# Altium schematic sheet Sheet2.SchDoc
size A2
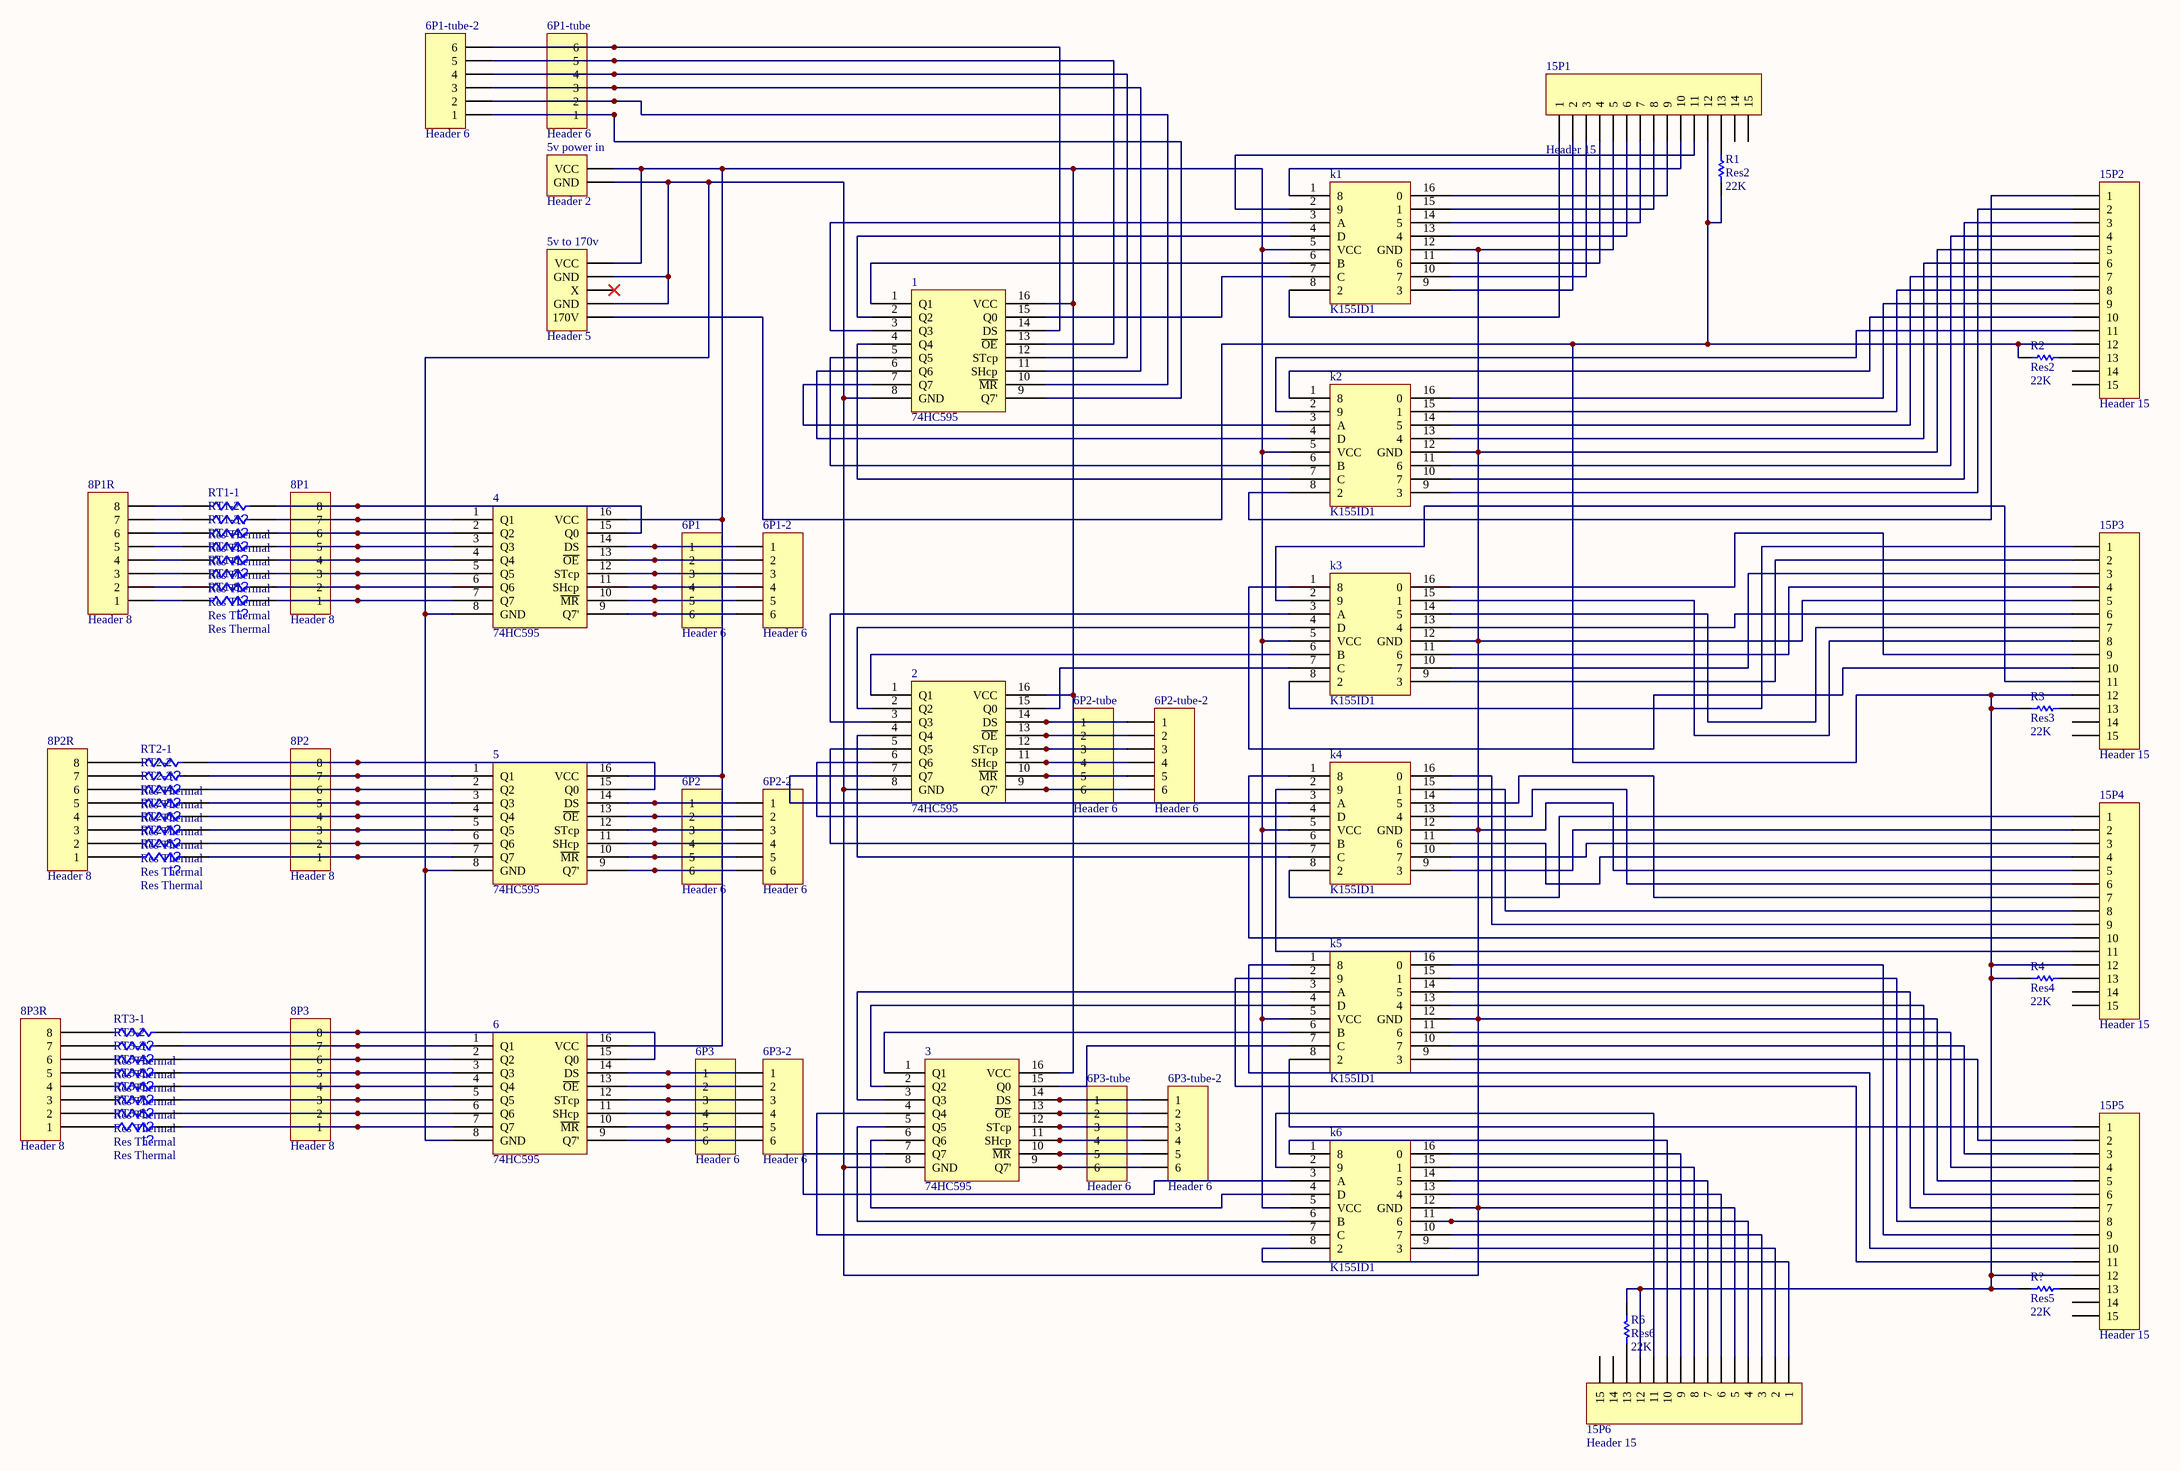
[diagram p0: Sheet2.SchDoc]

## Parts
1  74HC595  [*DIP254P762X444-16]
2  74HC595  [*DIP254P762X444-16]
3  74HC595  [*DIP254P762X444-16]
4  74HC595  [*DIP254P762X444-16]
5  74HC595  [*DIP254P762X444-16]
5v_power_in  Header 2  [HDR1X2]
5v_to_170v  Header 5  [HDR1X5]
6  74HC595  [*DIP254P762X444-16]
6P1  Header 6  [HDR1X6]
6P1-2  Header 6  [HDR1X6]
6P1-tube  Header 6  [HDR1X6]
6P1-tube-2  Header 6  [HDR1X6]
6P2  Header 6  [HDR1X6]
6P2-2  Header 6  [HDR1X6]
6P2-tube  Header 6  [HDR1X6]
6P2-tube-2  Header 6  [HDR1X6]
6P3  Header 6  [HDR1X6]
6P3-2  Header 6  [HDR1X6]
6P3-tube  Header 6  [HDR1X6]
6P3-tube-2  Header 6  [HDR1X6]
8P1  Header 8  [HDR1X8]
8P1R  Header 8  [HDR1X8]
8P2  Header 8  [HDR1X8]
8P2R  Header 8  [HDR1X8]
8P3  Header 8  [HDR1X8]
8P3R  Header 8  [HDR1X8]
15P1  Header 15  [HDR1X15]
15P2  Header 15  [HDR1X15]
15P3  Header 15  [HDR1X15]
15P4  Header 15  [HDR1X15]
15P5  Header 15  [HDR1X15]
15P6  Header 15  [HDR1X15]
k1  K155ID1  [K155ID1]
k2  K155ID1  [K155ID1]
k3  K155ID1  [K155ID1]
k4  K155ID1  [K155ID1]
k5  K155ID1  [K155ID1]
k6  K155ID1  [K155ID1]
R1  Res2  value 22K  [AXIAL-0.3]
R2  Res2  value 22K  [AXIAL-0.3]
R3  Res3  value 22K  [AXIAL-0.3]
R4  Res4  value 22K  [AXIAL-0.3]
R6  Res6  value 22K  [AXIAL-0.3]
R?  Res5  value 22K  [AXIAL-0.3]
RT1-1  Res Thermal  [6-0805_N]
RT1-2  Res Thermal  [6-0805_N]
RT1-3  Res Thermal  [6-0805_N]
RT1-4  Res Thermal  [6-0805_N]
RT1-5  Res Thermal  [6-0805_N]
RT1-6  Res Thermal  [6-0805_N]
RT1-7  Res Thermal  [6-0805_N]
RT1-8  Res Thermal  [6-0805_N]
RT2-1  Res Thermal  [6-0805_N]
RT2-2  Res Thermal  [6-0805_N]
RT2-3  Res Thermal  [6-0805_N]
RT2-4  Res Thermal  [6-0805_N]
RT2-5  Res Thermal  [6-0805_N]
RT2-6  Res Thermal  [6-0805_N]
RT2-7  Res Thermal  [6-0805_N]
RT2-8  Res Thermal  [6-0805_N]
RT3-1  Res Thermal  [6-0805_N]
RT3-2  Res Thermal  [6-0805_N]
RT3-3  Res Thermal  [6-0805_N]
RT3-4  Res Thermal  [6-0805_N]
RT3-5  Res Thermal  [6-0805_N]
RT3-6  Res Thermal  [6-0805_N]
RT3-7  Res Thermal  [6-0805_N]
RT3-8  Res Thermal  [6-0805_N]

## Nets
Net1_1: 1.1(Q1) k1.6(B)
Net1_2: 1.2(Q2) k1.4(D)
Net1_3: 1.3(Q3) k1.3(A)
Net1_4: 1.4(Q4) k2.7(C)
Net1_5: 1.5(Q5) k2.6(B)
Net1_6: 1.6(Q6) k2.4(D)
Net1_7: 1.7(Q7) k2.3(A)
Net1_8: 1.8(GND) 2.8(GND) 3.8(GND) 4.8(GND) 5.8(GND) 5v_power_in.1(GND) 5v_to_170v.2(GND) 5v_to_170v.4(GND) 6.8(GND) 15P1.5 15P2.5 15P3.5 15P4.5 15P5.5 15P6.5 k1.12(GND) k2.12(GND) k3.12(GND) k4.12(GND) k5.12(GND) k6.12(GND)
Net1_9: 1.9(Q7') 6P1-tube.1 6P1-tube-2.1
Net1_10: 1.10(~{MR}) 6P1-tube.2 6P1-tube-2.2
Net1_11: 1.11(SHcp) 6P1-tube.3 6P1-tube-2.3
Net1_12: 1.12(STcp) 6P1-tube.4 6P1-tube-2.4
Net1_13: 1.13(~{OE}) 6P1-tube.5 6P1-tube-2.5
Net1_14: 1.14(DS) 6P1-tube.6 6P1-tube-2.6
Net1_15: 1.15(Q0) k1.7(C)
Net1_16: 1.16(VCC) 2.16(VCC) 3.16(VCC) 4.16(VCC) 5.16(VCC) 5v_power_in.2(VCC) 5v_to_170v.1(VCC) 6.16(VCC) k1.5(VCC) k2.5(VCC) k3.5(VCC) k4.5(VCC) k5.5(VCC) k6.5(VCC)
Net2_1: 2.1(Q1) k3.6(B)
Net2_2: 2.2(Q2) k3.4(D)
Net2_3: 2.3(Q3) k3.3(A)
Net2_4: 2.4(Q4) k4.7(C)
Net2_5: 2.5(Q5) k4.6(B)
Net2_6: 2.6(Q6) k4.4(D)
Net2_7: 2.7(Q7) k4.3(A)
Net2_9: 2.9(Q7') 6P2-tube.6 6P2-tube-2.6
Net2_10: 2.10(~{MR}) 6P2-tube.5 6P2-tube-2.5
Net2_11: 2.11(SHcp) 6P2-tube.4 6P2-tube-2.4
Net2_12: 2.12(STcp) 6P2-tube.3 6P2-tube-2.3
Net2_13: 2.13(~{OE}) 6P2-tube.2 6P2-tube-2.2
Net2_14: 2.14(DS) 6P2-tube.1 6P2-tube-2.1
Net2_15: 2.15(Q0) k3.7(C)
Net3_1: 3.1(Q1) k5.6(B)
Net3_2: 3.2(Q2) k5.4(D)
Net3_3: 3.3(Q3) k5.3(A)
Net3_4: 3.4(Q4) k6.7(C)
Net3_5: 3.5(Q5) k6.6(B)
Net3_6: 3.6(Q6) k6.4(D)
Net3_7: 3.7(Q7) k6.3(A)
Net3_9: 3.9(Q7') 6P3-tube.6 6P3-tube-2.6
Net3_10: 3.10(~{MR}) 6P3-tube.5 6P3-tube-2.5
Net3_11: 3.11(SHcp) 6P3-tube.4 6P3-tube-2.4
Net3_12: 3.12(STcp) 6P3-tube.3 6P3-tube-2.3
Net3_13: 3.13(~{OE}) 6P3-tube.2 6P3-tube-2.2
Net3_14: 3.14(DS) 6P3-tube.1 6P3-tube-2.1
Net3_15: 3.15(Q0) k5.7(C)
Net4_1: 4.1(Q1) 8P1.7 RT1-2.1
Net4_2: 4.2(Q2) 8P1.6 RT1-3.1
Net4_3: 4.3(Q3) 8P1.5 RT1-4.1
Net4_4: 4.4(Q4) 8P1.4 RT1-5.1
Net4_5: 4.5(Q5) 8P1.3 RT1-6.1
Net4_6: 4.6(Q6) 8P1.2 RT1-7.1
Net4_7: 4.7(Q7) 8P1.1 RT1-8.1
Net4_9: 4.9(Q7') 6P1.6 6P1-2.6
Net4_10: 4.10(~{MR}) 6P1.5 6P1-2.5
Net4_11: 4.11(SHcp) 6P1.4 6P1-2.4
Net4_12: 4.12(STcp) 6P1.3 6P1-2.3
Net4_13: 4.13(~{OE}) 6P1.2 6P1-2.2
Net4_14: 4.14(DS) 6P1.1 6P1-2.1
Net4_15: 4.15(Q0) 8P1.8 RT1-1.1
Net5_1: 5.1(Q1) 8P2.7 RT2-2.1
Net5_2: 5.2(Q2) 8P2.6 RT2-3.1
Net5_3: 5.3(Q3) 8P2.5 RT2-4.1
Net5_4: 5.4(Q4) 8P2.4 RT2-5.1
Net5_5: 5.5(Q5) 8P2.3 RT2-6.1
Net5_6: 5.6(Q6) 8P2.2 RT2-7.1
Net5_7: 5.7(Q7) 8P2.1 RT2-8.1
Net5_9: 5.9(Q7') 6P2.6 6P2-2.6
Net5_10: 5.10(~{MR}) 6P2.5 6P2-2.5
Net5_11: 5.11(SHcp) 6P2.4 6P2-2.4
Net5_12: 5.12(STcp) 6P2.3 6P2-2.3
Net5_13: 5.13(~{OE}) 6P2.2 6P2-2.2
Net5_14: 5.14(DS) 6P2.1 6P2-2.1
Net5_15: 5.15(Q0) 8P2.8 RT2-1.1
Net5v_to_170v_5: 5v_to_170v.5(170V) 15P1.12 15P2.12 15P3.12 15P4.12 15P5.12 15P6.12 R1.1 R2.1 R3.1 R4.1 R6.2 R?.1
Net6_1: 6.1(Q1) 8P3.7 RT3-2.1
Net6_2: 6.2(Q2) 8P3.6 RT3-3.1
Net6_3: 6.3(Q3) 8P3.5 RT3-4.1
Net6_4: 6.4(Q4) 8P3.4 RT3-5.1
Net6_5: 6.5(Q5) 8P3.3 RT3-6.1
Net6_6: 6.6(Q6) 8P3.2 RT3-7.1
Net6_7: 6.7(Q7) 8P3.1 RT3-8.1
Net6_9: 6.9(Q7') 6P3.6 6P3-2.6
Net6_10: 6.10(~{MR}) 6P3.5 6P3-2.5
Net6_11: 6.11(SHcp) 6P3.4 6P3-2.4
Net6_12: 6.12(STcp) 6P3.3 6P3-2.3
Net6_13: 6.13(~{OE}) 6P3.2 6P3-2.2
Net6_14: 6.14(DS) 6P3.1 6P3-2.1
Net6_15: 6.15(Q0) 8P3.8 RT3-1.1
Net8P1R_1: 8P1R.1 RT1-8.2
Net8P1R_2: 8P1R.2 RT1-7.2
Net8P1R_3: 8P1R.3 RT1-6.2
Net8P1R_4: 8P1R.4 RT1-5.2
Net8P1R_5: 8P1R.5 RT1-4.2
Net8P1R_6: 8P1R.6 RT1-3.2
Net8P1R_7: 8P1R.7 RT1-2.2
Net8P1R_8: 8P1R.8 RT1-1.2
Net8P2R_1: 8P2R.1 RT2-8.2
Net8P2R_2: 8P2R.2 RT2-7.2
Net8P2R_3: 8P2R.3 RT2-6.2
Net8P2R_4: 8P2R.4 RT2-5.2
Net8P2R_5: 8P2R.5 RT2-4.2
Net8P2R_6: 8P2R.6 RT2-3.2
Net8P2R_7: 8P2R.7 RT2-2.2
Net8P2R_8: 8P2R.8 RT2-1.2
Net8P3R_1: 8P3R.1 RT3-8.2
Net8P3R_2: 8P3R.2 RT3-7.2
Net8P3R_3: 8P3R.3 RT3-6.2
Net8P3R_4: 8P3R.4 RT3-5.2
Net8P3R_5: 8P3R.5 RT3-4.2
Net8P3R_6: 8P3R.6 RT3-3.2
Net8P3R_7: 8P3R.7 RT3-2.2
Net8P3R_8: 8P3R.8 RT3-1.2
Net15P1_1: 15P1.1 k1.8(2)
Net15P1_2: 15P1.2 k1.9(3)
Net15P1_3: 15P1.3 k1.10(7)
Net15P1_4: 15P1.4 k1.11(6)
Net15P1_6: 15P1.6 k1.13(4)
Net15P1_7: 15P1.7 k1.14(5)
Net15P1_8: 15P1.8 k1.15(1)
Net15P1_9: 15P1.9 k1.16(0)
Net15P1_10: 15P1.10 k1.1(8)
Net15P1_11: 15P1.11 k1.2(9)
Net15P1_13: 15P1.13 R1.2
Net15P2_1: 15P2.1 k2.8(2)
Net15P2_2: 15P2.2 k2.9(3)
Net15P2_3: 15P2.3 k2.10(7)
Net15P2_4: 15P2.4 k2.11(6)
Net15P2_6: 15P2.6 k2.13(4)
Net15P2_7: 15P2.7 k2.14(5)
Net15P2_8: 15P2.8 k2.15(1)
Net15P2_9: 15P2.9 k2.16(0)
Net15P2_10: 15P2.10 k2.1(8)
Net15P2_11: 15P2.11 k2.2(9)
Net15P2_13: 15P2.13 R2.2
Net15P3_1: 15P3.1 k3.8(2)
Net15P3_2: 15P3.2 k3.9(3)
Net15P3_3: 15P3.3 k3.10(7)
Net15P3_4: 15P3.4 k3.11(6)
Net15P3_6: 15P3.6 k3.13(4)
Net15P3_7: 15P3.7 k3.14(5)
Net15P3_8: 15P3.8 k3.15(1)
Net15P3_9: 15P3.9 k3.16(0)
Net15P3_10: 15P3.10 k3.1(8)
Net15P3_11: 15P3.11 k3.2(9)
Net15P3_13: 15P3.13 R3.2
Net15P4_1: 15P4.1 k4.8(2)
Net15P4_2: 15P4.2 k4.9(3)
Net15P4_3: 15P4.3 k4.10(7)
Net15P4_4: 15P4.4 k4.11(6)
Net15P4_6: 15P4.6 k4.13(4)
Net15P4_7: 15P4.7 k4.14(5)
Net15P4_8: 15P4.8 k4.15(1)
Net15P4_9: 15P4.9 k4.16(0)
Net15P4_10: 15P4.10 k4.1(8)
Net15P4_11: 15P4.11 k4.2(9)
Net15P4_13: 15P4.13 R4.2
Net15P5_1: 15P5.1 k5.8(2)
Net15P5_2: 15P5.2 k5.9(3)
Net15P5_3: 15P5.3 k5.10(7)
Net15P5_4: 15P5.4 k5.11(6)
Net15P5_6: 15P5.6 k5.13(4)
Net15P5_7: 15P5.7 k5.14(5)
Net15P5_8: 15P5.8 k5.15(1)
Net15P5_9: 15P5.9 k5.16(0)
Net15P5_10: 15P5.10 k5.1(8)
Net15P5_11: 15P5.11 k5.2(9)
Net15P5_13: 15P5.13 R?.2
Net15P6_1: 15P6.1 k6.8(2)
Net15P6_2: 15P6.2 k6.9(3)
Net15P6_3: 15P6.3 k6.10(7)
Net15P6_4: 15P6.4 k6.11(6)
Net15P6_6: 15P6.6 k6.13(4)
Net15P6_7: 15P6.7 k6.14(5)
Net15P6_8: 15P6.8 k6.15(1)
Net15P6_9: 15P6.9 k6.16(0)
Net15P6_10: 15P6.10 k6.1(8)
Net15P6_11: 15P6.11 k6.2(9)
Net15P6_13: 15P6.13 R6.1

Not connected (* = marked no-connect by the designer): 5v_to_170v 3(X)*; 15P1 14 15; 15P2 14 15; 15P3 14 15; 15P4 14 15; 15P5 14 15; 15P6 14 15

## Notes on the sheet
- (in symbol Res Thermal) t?

## Library data of the parts
5v_power_in = Header 2: Header, 2-Pin; LatestRevisionDate: 17-Jul-2002; LatestRevisionNote: Re-released for DXP Platform.; Publisher: Altium Limited
5v_to_170v = Header 5: Header, 5-Pin; LatestRevisionDate: 17-Jul-2002; LatestRevisionNote: Re-released for DXP Platform.; Publisher: Altium Limited
6P1 6P1-2 6P1-tube 6P1-tube-2 6P2 6P2-2 6P2-tube 6P2-tube-2 6P3 6P3-2 6P3-tube 6P3-tube-2 = Header 6: Header, 6-Pin; LatestRevisionDate: 17-Jul-2002; LatestRevisionNote: Re-released for DXP Platform.; Publisher: Altium Limited
8P1 8P1R 8P2 8P2R 8P3 8P3R = Header 8: Header, 8-Pin; LatestRevisionDate: 17-Jul-2002; LatestRevisionNote: Re-released for DXP Platform.; Publisher: Altium Limited
15P1-15P6 = Header 15: Header, 15-Pin; LatestRevisionDate: 17-Jul-2002; LatestRevisionNote: Re-released for DXP Platform.; Publisher: Altium Limited
R1-R4 R6 R? = Res1: Resistor; Published: 8-Jun-2000; LatestRevisionDate: 17-Jul-2002; LatestRevisionNote: Re-released for DXP Platform.; PackageReference: AXIAL-0.3; Publisher: Altium Limited; PackageDescription: Axial Device, Thru-Hole; 2 Leads; 0.3 in Pin Spacing
RT1-1-RT1-8 RT2-1-RT2-8 RT3-1-RT3-8 = Res Thermal: Thermistor; Published: 24-Mar-1999; LatestRevisionDate: 29-May-2009; LatestRevisionNote: IPC-7351 Footprint Added.; PackageVersion: Mar-2003; PackageReference: 6-0805; Publisher: Altium Limited; PackageDescription: Chip Resistor 0805 Case Size; Code_IPC: RESC2012